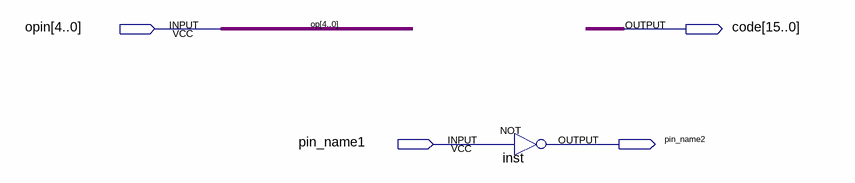
[diagram p0: schematic sheet]
// Quartus schematic 444.bdf as structural Verilog: 1 symbols, 4 pins
module \444  (
  input  [4:0] opin,
  input  pin_name1,
  output [15:0] code,
  output pin_name2
);

  not inst (pin_name2, pin_name1);

  // Other names for the same wires on the sheet: op[4:0] = opin
endmodule
